# EasyEDA schematic 4.11.json
TITLE: Sheet_1; REV: 1.0; Date: 2020-11-17; Sheet: 1/1; Drawn By: Gökbey Keskin; Company: Your Company
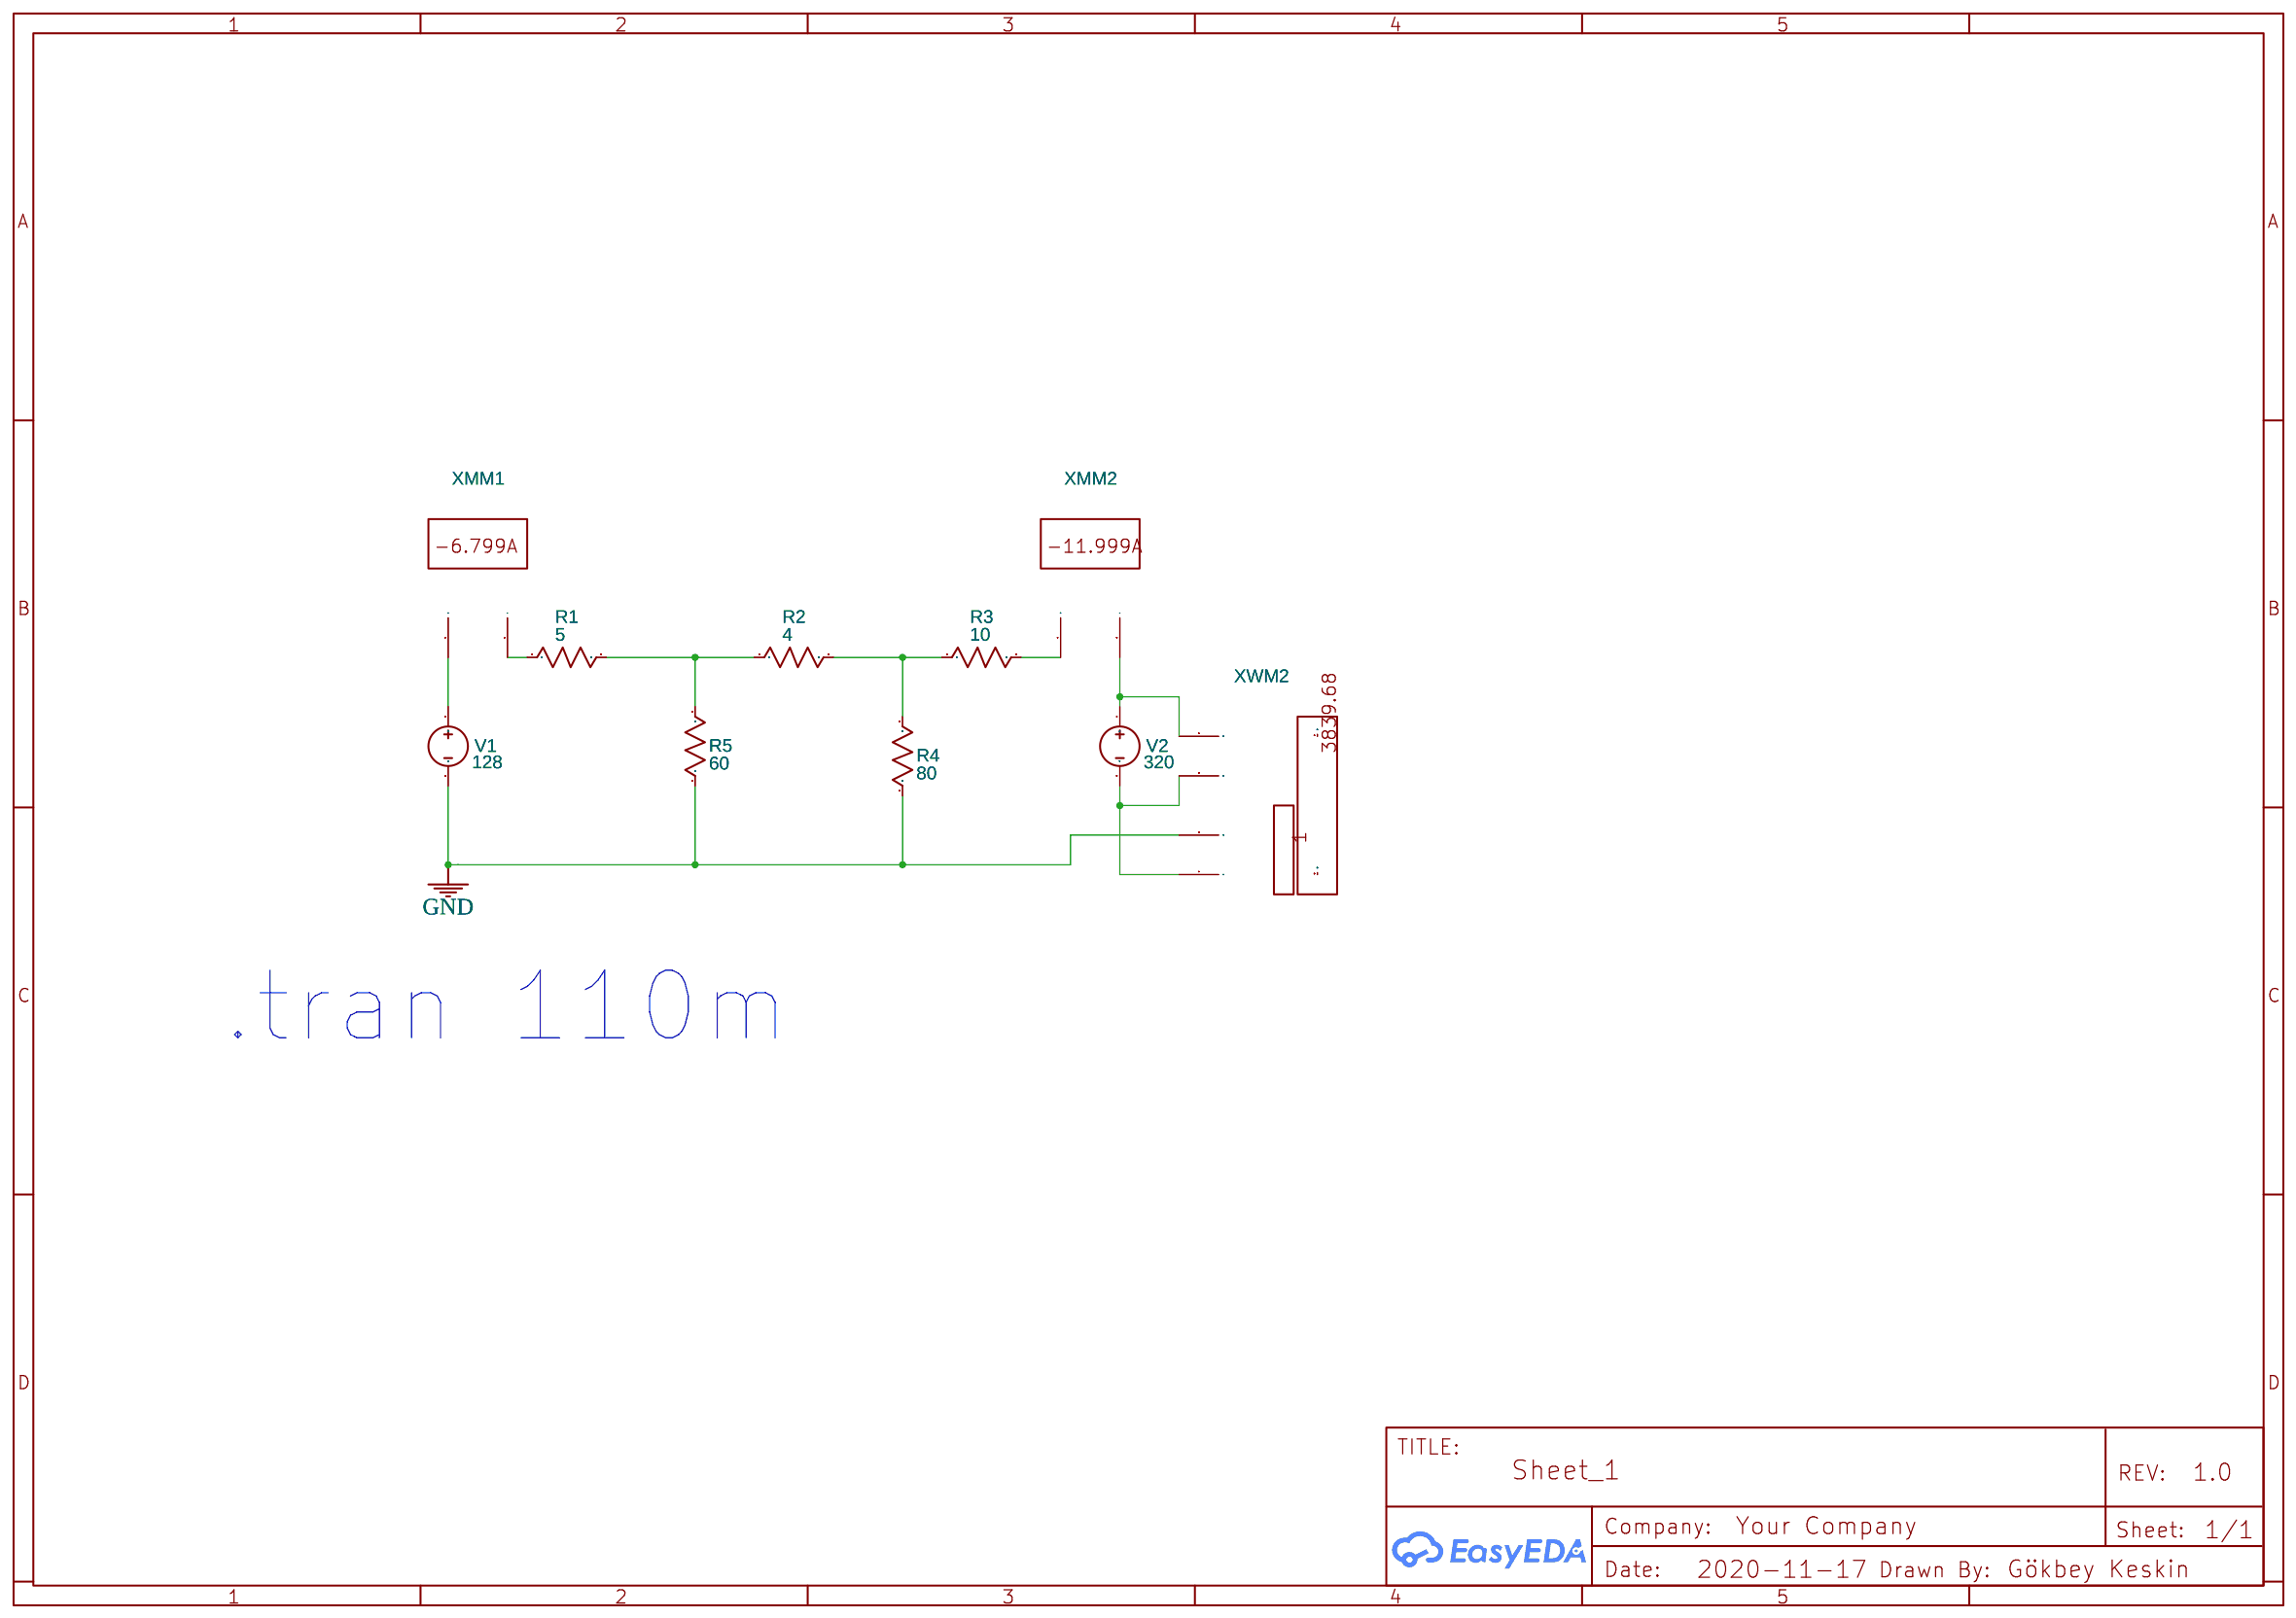
[diagram p0: schematic sheet]

## Parts
R1  5  [AXIAL-0.3]
R2  4  [AXIAL-0.3]
R3  10  [AXIAL-0.3]
R4  80  [AXIAL-0.3]
R5  60  [AXIAL-0.3]
V1  128  [HDR1X2]
V2  320  [HDR1X2]
XMM1  Multimeter
XMM2  Multimeter
XWM2  Wattmeter

## Library data of the parts
R1-R5 = Resistor_US: Resistance: 1k; Contributor: EasyEDA; Supplier: YUJING
V1 V2 = VDC: Contributor: EasyEDA; sim: true
XMM1 XMM2 = MULTIMETER: Supplier: LCSC; Multimeter Type: Amper; Power Type: AC; Voltmeter resistance: 10μ; Ammeter resistance: 1G; NameDisplay: 0; Contributor: EasyEDA; sim: true
XWM2 = WATTMETER: Contributor: EasyEDA; NameDisplay: 0; sim: true

## Nets
GND: R4.1 R5.1 V1.2 XWM2.3(I+)
Net-(R1-1): R1.1 XMM1.2(I)
Net-(R1-2): R1.2 R2.1 R5.2
Net-(R2-2): R2.2 R3.1 R4.2
Net-(R3-2): R3.2 XMM2.1(+)
Net-(V1-1): V1.1 XMM1.1(+)
Net-(V2-1): V2.1 XMM2.2(I) XWM2.1(V+)
Net-(V2-2): V2.2 XWM2.2(V-) XWM2.4(I-)

Not connected (* = marked no-connect by the designer): XWM2 P PF

## Notes on the sheet
- .tran 110m
